# EAGLE design WIFI_Light (EAGLE 7.1.0)
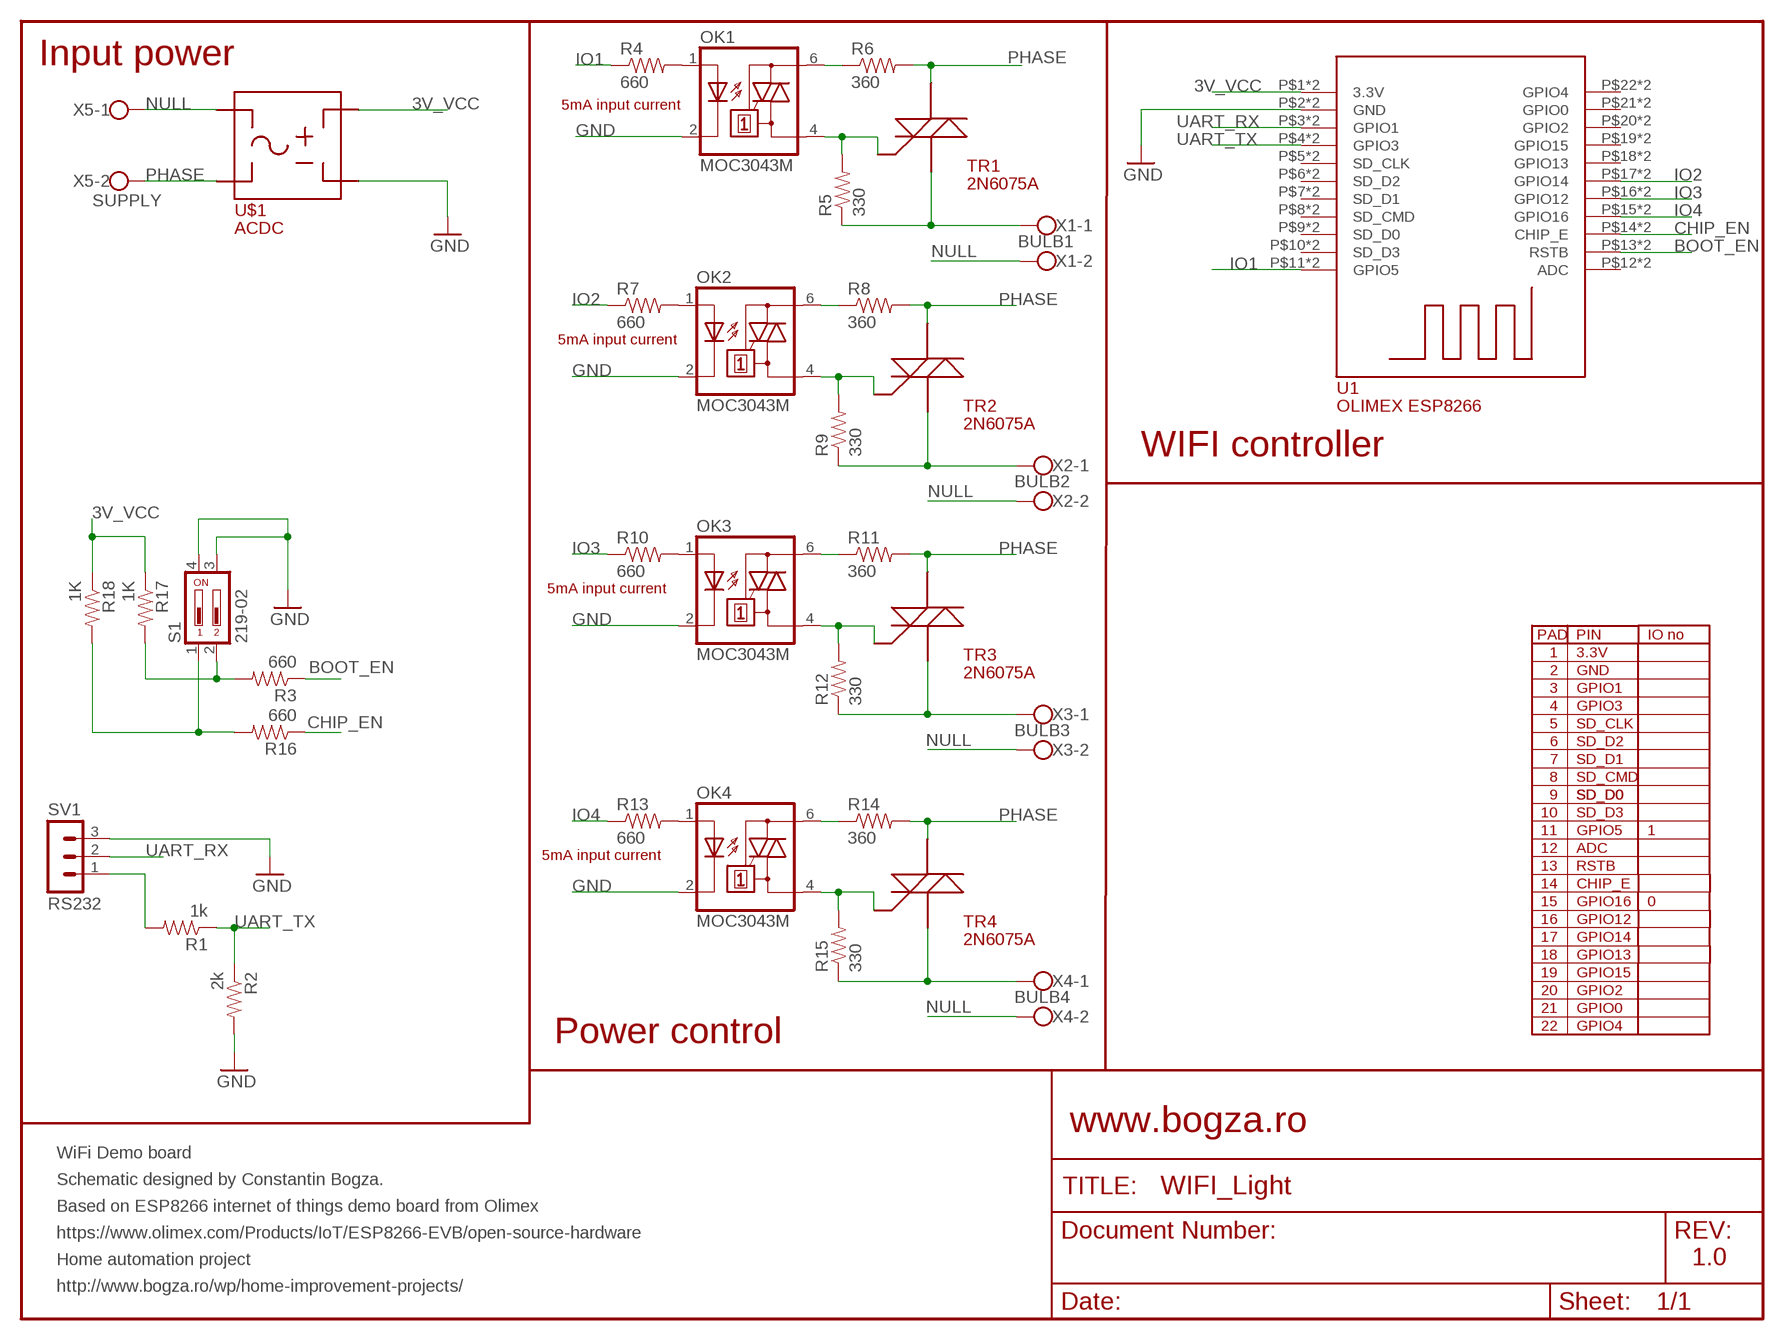
[diagram p0: schematic, sheet 1]

## Parts
OK1  MOC3043M  [DIL06]
OK2  MOC3043M  [DIL06]
OK3  MOC3043M  [DIL06]
OK4  MOC3043M  [DIL06]
R1  1k  RESISTOR1206  [1206]
R2  2k  RESISTOR1206  [1206]
R3  660  RESISTOR1206  [1206]
R4  660  RESISTOR1206  [1206]
R5  330  RESISTOR1206  [1206]
R6  360  RESISTOR1206  [1206]
R7  660  RESISTOR1206  [1206]
R8  360  RESISTOR1206  [1206]
R9  330  RESISTOR1206  [1206]
R10  660  RESISTOR1206  [1206]
R11  360  RESISTOR1206  [1206]
R12  330  RESISTOR1206  [1206]
R13  660  RESISTOR1206  [1206]
R14  360  RESISTOR1206  [1206]
R15  330  RESISTOR1206  [1206]
R16  660  RESISTOR1206  [1206]
R17  1K  RESISTOR1206  [1206]
R18  1K  RESISTOR1206  [1206]
S1  219-02  [CTS-219-02]
SV1  RS232  MA03-1  [MA03-1]
TR1  2N6071A/B  [TO–225AA]
TR2  2N6071A/B  [TO–225AA]
TR3  2N6071A/B  [TO–225AA]
TR4  2N6071A/B  [TO–225AA]
U1  OLIMEX_ESP8266  [OLIMEX_ESP8266_DIP22]
U$1  ACDC_220V_3V3  [ACDC_220V_3V3]
X1  BULB1  W237-102  [W237-102]
X2  BULB2  W237-102  [W237-102]
X3  BULB3  W237-102  [W237-102]
X4  BULB4  W237-102  [W237-102]
X5  SUPPLY  W237-102  [W237-102]

## Nets
3V_VCC: R17.1 R18.1 U1.P$1(3.3V) U1.P$23(3.3V) U$1.VCC
BOOT_EN: R3.1 U1.P$13(RSTB) U1.P$35(RSTB)
CHIP_EN: R16.1 U1.P$14(CHIP_E) U1.P$36(CHIP_E)
GND: OK1.2(C) OK2.2(C) OK3.2(C) OK4.2(C) R2.2 S1.3 S1.4 SV1.3 U1.P$2(GND) U1.P$24(GND) U$1.GND
IO1: R4.1 U1.P$11(GPIO5) U1.P$33(GPIO5)
IO2: R7.1 U1.P$17(GPIO14) U1.P$39(GPIO14)
IO3: R10.1 U1.P$16(GPIO12) U1.P$38(GPIO12)
IO4: R13.1 U1.P$15(GPIO16) U1.P$37(GPIO16)
N$1: OK1.6(A2) R6.1
N$2: OK1.1(A) R4.2
N$3: R3.2 R17.2 S1.2
N$5: R16.2 R18.2 S1.1
N$7: OK1.4(A1) R5.2 TR1.G
N$9: OK2.6(A2) R8.1
N$10: R1.2 SV1.1
N$13: OK2.1(A) R7.2
N$16: OK2.4(A1) R9.2 TR2.G
N$18: OK3.6(A2) R11.1
N$20: OK3.1(A) R10.2
N$23: OK3.4(A1) R12.2 TR3.G
N$25: OK4.6(A2) R14.1
N$27: OK4.1(A) R13.2
N$30: OK4.4(A1) R15.2 TR4.G
NULL: U$1.PHASE X1.2 X2.2 X3.2 X4.2 X5.1
OUT1: R5.1 TR1.MT1 X1.1
OUT2: R9.1 TR2.MT1 X2.1
OUT3: R12.1 TR3.MT1 X3.1
OUT4: R15.1 TR4.MT1 X4.1
PHASE: R6.2 R8.2 R11.2 R14.2 TR1.MT2 TR2.MT2 TR3.MT2 TR4.MT2 U$1.NULL X5.2
UART_RX: SV1.2 U1.P$3(GPIO1) U1.P$25(GPIO1)
UART_TX: R1.1 R2.1 U1.P$4(GPIO3) U1.P$26(GPIO3)
Unconnected: U1.P$5(SD_CLK) U1.P$6(SD_D2) U1.P$7(SD_D1) U1.P$8(SD_CMD) U1.P$9(SD_D0) U1.P$10(SD_D3) U1.P$12(ADC) U1.P$18(GPIO13) U1.P$19(GPIO15) U1.P$20(GPIO2) U1.P$21(GPIO0) U1.P$22(GPIO4) U1.P$27(SD_CLK) U1.P$28(SD_D2) U1.P$29(SD_D1) U1.P$30(SD_CMD) U1.P$31(SD_D0) U1.P$32(SD_D3) U1.P$34(ADC) U1.P$40(GPIO13) U1.P$41(GPIO15) U1.P$42(GPIO2) U1.P$43(GPIO0) U1.P$44(GPIO4)

## Notes on the sheet
- Input power
- 5mA input current
- 5mA input current
- WIFI controller
- 5mA input current
- PAD | PIN | IO no
- 1 | 3.3V
- 2 | GND
- 3 | GPIO1
- 4 | GPIO3
- 5 | SD_CLK
- 6 | SD_D2
- 7 | SD_D1
- 8 | SD_CMD
- 9 | SD_D0 | SD_D0
- 10 | SD_D3
- 11 | GPIO5 | 1
- 12 | ADC
- 5mA input current
- 13 | RSTB
- 14 | CHIP_E
- 15 | GPIO16 | 0
- 16 | GPIO12
- 17 | GPIO14
- 18 | GPIO13
- 19 | GPIO15
- 20 | GPIO2
- 21 | GPIO0
- 22 | GPIO4
- Power control
- www.bogza.ro
- WiFi Demo board
- Schematic designed by Constantin Bogza.
- Based on ESP8266 internet of things demo board from Olimex
- https://www.olimex.com/Products/IoT/ESP8266-EVB/open-source-hardware
- Home automation project | 1.0
- http://www.bogza.ro/wp/home-improvement-projects/

## Library data of the parts
OK1-OK4 = optocoupler:MOC30*: 6-Pin DIP Zero-Cross Optoisolators Triac Driver Output (250/400 Volt Peak) Source: Data sheet <http://www.fairchildsemi.com/ds/MO/MOC3031M.pdf> The old path of data sheet not more available 2013-05-06.; MF: FAIRCHILD SEMICONDUCTOR; MPN: MOC3043-M; OC_FARNELL: 1021371; OC_NEWARK: 72K8900
R1-R18 = SparkFun:RESISTOR: Resistor Basic schematic elements and footprints for 0603, 1206, and PTH 1/10th watt (small) resistors.
S1 = switch-dil:219-02*: Surface Mount DIP Switch Series 219 SMT CTS Electronic Components Sourc: www.ctscorp.com; OC_FARNELL: unknown; OC_NEWARK: unknown
SV1 = con-lstb:MA03-1: PIN HEADER; OC_FARNELL: unknown; OC_NEWARK: unknown
TR1-TR4 = Olimex_ESP8266:2N6071A/B
U1 = Olimex_ESP8266:OLIMEX_ESP8266
U$1 = Olimex_ESP8266:ACDC_220V_3V3
X1-X5 = con-wago-500:W237-102: WAGO SCREW CLAMP; MPN: 237-102; OC_FARNELL: unknown; OC_NEWARK: 70K9898

## Net classes
0 default: width 0.203 mm, drill 0.305 mm, clearance 0.205 mm

## Board
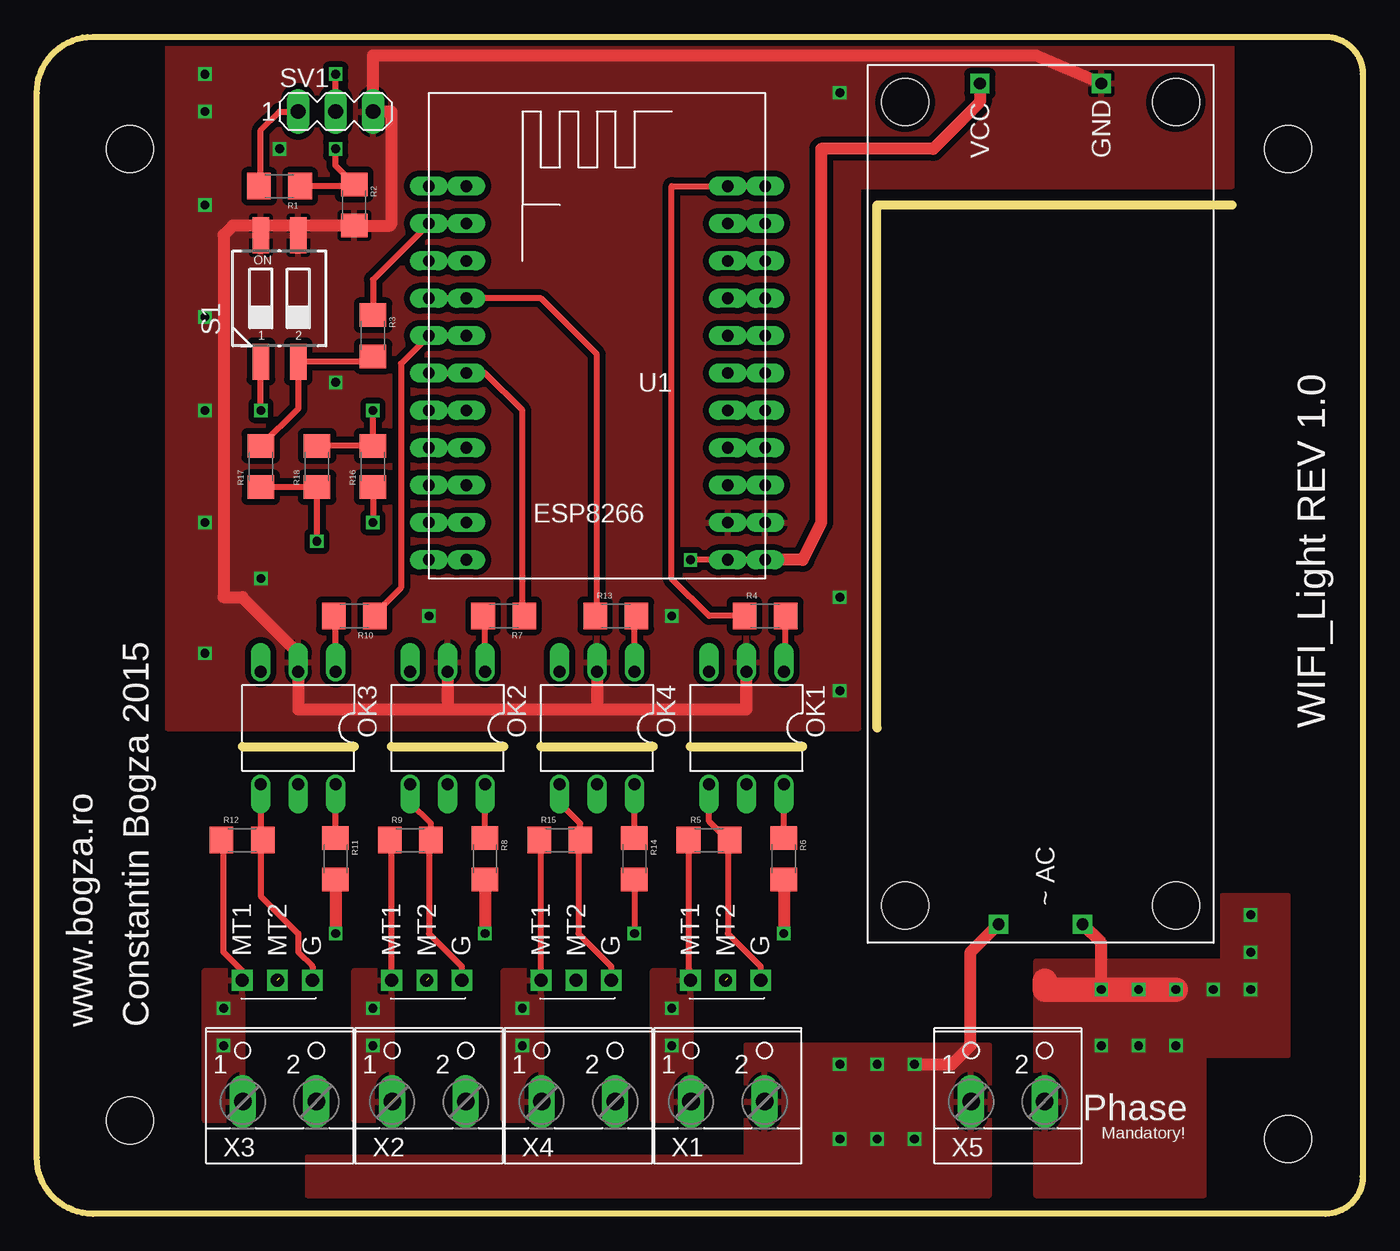
[diagram p1: board, top side]
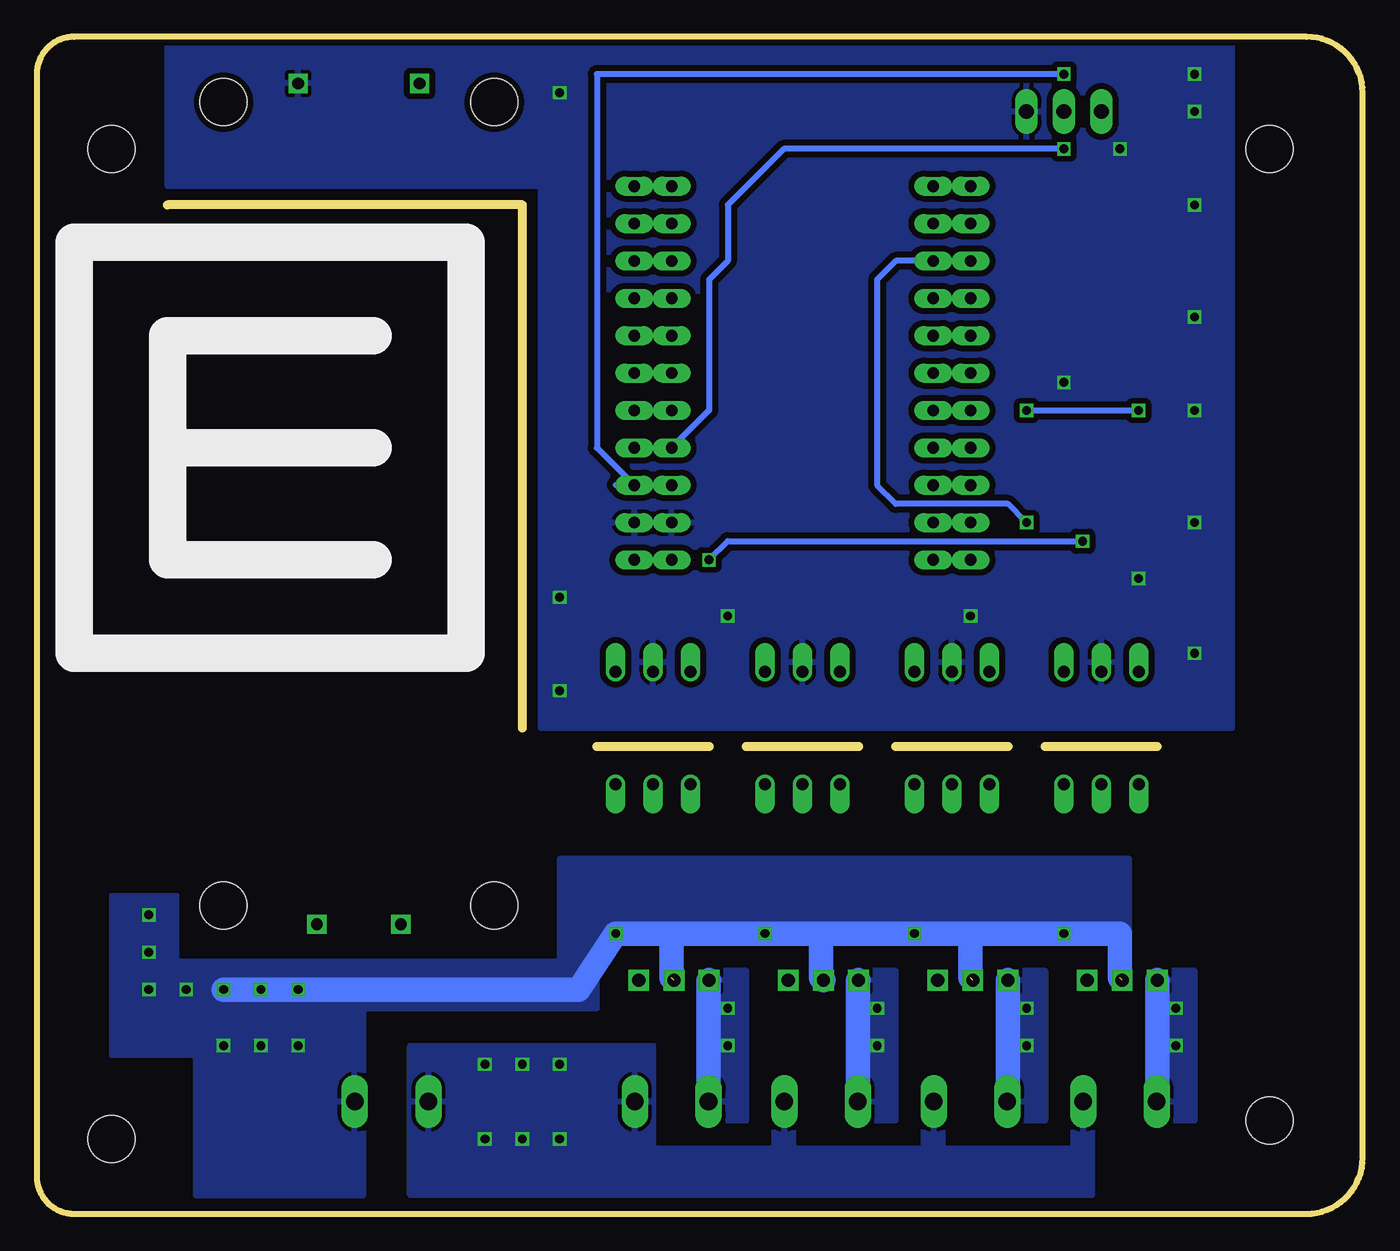
[diagram p2: board, bottom side, seen from below]

Size 90.17 x 80.01 mm. Coordinates in mm from the lower left corner, seen from the top.
Outline: 87.63,0 86.67,0
Outline: 87.63,0 3.81,0 arc-90 0,3.81 0,76.2 arc-90 3.81,80.01 87.63,80.01 arc-90 90.17,77.47 90.17,2.54 arc-90 87.63,0
Outline: 13.97,31.75 21.59,31.75
Outline: 24.13,31.75 31.75,31.75
Outline: 34.29,31.75 41.91,31.75
Outline: 44.45,31.75 52.07,31.75
Outline: 57.15,33.02 57.15,68.58 81.28,68.58
Copper layers (1*16): Top 0.035mm / dielectric 1.5mm / Bottom 0.035mm
Design rules "dirt_cheap_dirty_boards.v1": minimum track width 5mil, minimum drill 12mil, track to track 5mil, track to pad 5mil, pad to pad 5mil, via to via 5mil, smd to smd 0mil, copper to edge 10mil, drill to drill 10mil, minimum pad ring 10mil, minimum via ring 6mil, stop-mask expansion 2mil, vias tented up to drill 25mil, thermal gap 10mil
Holes 3.2 mm at 85.09,72.39 85.09,5.08 6.35,6.35 6.35,72.39

### Footprints (pad centres in the part's own frame; a part is rotated, then mirrored left to right if it is on the bottom)
DIL06 = drill 0.813 offset: 1 -2.54,-3.81; 2 0,-3.81; 3 2.54,-3.81; 4 2.54,3.81; 5 0,3.81; 6 -2.54,3.81
1206 = smd 1.6 x 1.8: 1 -1.4,0; 2 1.4,0
CTS-219-02 = smd 1.13 x 2.44: 1 -1.27,-4.3; 2 1.27,-4.3; 3 1.27,4.3; 4 -1.27,4.3
MA03-1 = drill 1.016 long: 1 -2.54,0; 2 0,0; 3 2.54,0
TO–225AA = drill 0.9 square: G 0,-4.775; MT1 0,0; MT2 0,-2.388
OLIMEX_ESP8266_DIP22 = drill 0.8 long: P$1 -8.89,17.78; P$2 -8.89,15.24; P$3 -8.89,12.7; P$4 -8.89,10.16; P$5 -8.89,7.62; P$6 -8.89,5.08; P$7 -8.89,2.54; P$8 -8.89,0; P$9 -8.89,-2.54; P$10 -8.89,-5.08; P$11 -8.89,-7.62; P$12 8.89,-7.62; P$13 8.89,-5.08; P$14 8.89,-2.54; P$15 8.89,0; P$16 8.89,2.54; P$17 8.89,5.08; P$18 8.89,7.62; P$19 8.89,10.16; P$20 8.89,12.7; P$21 8.89,15.24; P$22 8.89,17.78; P$23 -11.43,17.78; P$24 -11.43,15.24; P$25 -11.43,12.7; P$26 -11.43,10.16; P$27 -11.43,7.62; P$28 -11.43,5.08; P$29 -11.43,2.54; P$30 -11.43,0; P$31 -11.43,-2.54; P$32 -11.43,-5.08; P$33 -11.43,-7.62; P$34 11.43,-7.62; P$35 11.43,-5.08; P$36 11.43,-2.54; P$37 11.43,0; P$38 11.43,2.54; P$39 11.43,5.08; P$40 11.43,7.62; P$41 11.43,10.16; P$42 11.43,12.7; P$43 11.43,15.24; P$44 11.43,17.78
ACDC_220V_3V3 = drill 0.8 square: GND 30.48,0; NULL -26.67,1.27; PHASE -26.67,6.985; VCC 30.48,8.255 | hole 3.2: -25.4,13.335; 29.21,13.335; -25.4,-5.08; 29.21,-5.08
W237-102 = drill 1.194 long: 1 -2.5,-1.27; 2 2.5,-1.27

### Placement (x,y rotation side)
OK1  48.26,33.02 180 top
OK2  27.94,33.02 180 top
OK3  17.78,33.02 180 top
OK4  38.1,33.02 180 top
R1  16.51,69.85 180 top
R2  21.59,68.58 270 top
R3  22.86,59.69 270 top
R4  49.53,40.64 0 top
R5  45.72,25.4 0 top
R6  50.8,24.13 270 top
R7  31.75,40.64 180 top
R8  30.48,24.13 270 top
R9  25.4,25.4 0 top
R10  21.59,40.64 180 top
R11  20.32,24.13 270 top
R12  13.97,25.4 0 top
R13  39.37,40.64 0 top
R14  40.64,24.13 270 top
R15  35.56,25.4 0 top
R16  22.86,50.8 90 top
R17  15.24,50.8 90 top
R18  19.05,50.8 90 top
S1  16.51,62.23 0 top
SV1  20.32,74.93 0 top
TR1  44.45,15.88 90 top
TR2  24.13,15.88 90 top
TR3  13.97,15.88 90 top
TR4  34.29,15.88 90 top
U1  38.1,62.23 180 top
U$1  72.39,46.35 90 top
X1  46.99,8.89 0 top
X2  26.67,8.89 0 top
X3  16.51,8.89 0 top
X4  36.83,8.89 0 top
X5  66.04,8.89 0 top

### Tracks (layer width: path | path; a pad name or v marks a point on that pad's centre or on a via)
3V_VCC  (via drill 0.6)
  Top 0.406: U1.P$23 U1.P$1 v44.45,44.45 | v19.05,45.72 R18.1 R17.1
  Top 0.813: U1.P$23 52.07,44.45 53.34,46.99 53.34,72.39 60.96,72.39 64.14,75.56 U$1.VCC
  Bottom 0.406: v44.45,44.45 43.18,45.72 v19.05,45.72
BOOT_EN
  Top 0.406: U1.P$13 U1.P$35 22.86,63.5 R3.1
CHIP_EN  (via drill 0.6)
  Top 0.406: R16.1 v22.86,46.99
  Bottom 0.406: v22.86,46.99 24.13,48.26 31.75,48.26 33.02,49.53 33.02,63.5 31.75,64.77 U1.P$14 U1.P$36
GND  (via drill 0.6)
  Top 0.813: 17.78,67.18 R2.2 24,67.18 24.13,67.31 24.13,74.93 SV1.3 22.86,78.74 67.94,78.74 U$1.GND | 17.78,67.18 15.24,67.18 | 15.24,67.18 13.35,67.18 12.7,66.53 12.7,41.91 13.97,41.91 17.78,38.1 OK3.2 17.78,34.29 27.94,34.29 | S1.3 17.78,67.18 | S1.4 15.24,67.18 | OK2.2 27.94,34.29 | 27.94,34.29 38.1,34.29 | OK4.2 38.1,34.29 | 38.1,34.29 48.26,34.29 OK1.2
  other vias: 11.43,77.47 11.43,74.93 11.43,68.58 11.43,60.96 11.43,54.61 11.43,46.99 11.43,38.1 15.24,43.18 26.67,40.64 43.18,40.64 54.61,41.91 54.61,35.56 54.61,76.2 16.51,72.39 20.32,56.52
  pour Top (isolate 0.406): 8.89,33.02 55.88,33.02 55.88,69.85 81.28,69.85 81.28,80.01 8.89,80.01
  pour Bottom (isolate 0.406): 8.89,80.01 8.89,33.02 55.88,33.02 55.88,69.85 81.28,69.85 81.28,80.01
IO1
  Top 0.406: R4.1 45.72,40.64 43.18,43.18 43.18,69.85 U1.P$11 U1.P$33
IO2
  Top 0.406: R7.1 33.02,40.77 33.02,54.61 30.48,57.15 U1.P$17 U1.P$39
IO3
  Top 0.406: U1.P$16 U1.P$38 24.77,57.78 24.77,42.55 22.99,40.77 R10.1
IO4
  Top 0.406: R13.1 38.1,40.77 38.1,58.42 34.29,62.23 U1.P$15 U1.P$37
N$1
  Top 0.406: R6.1 OK1.6
N$2
  Top 0.406: OK1.1 50.93,36.96 R4.2
N$3
  Top 0.406: R3.2 22.5,57.93 S1.2 17.78,54.74 R17.2
N$5  (via drill 0.6)
  Top 0.406: R18.2 R16.2 v22.86,54.61 | v15.24,54.61 S1.1
  Bottom 0.406: v22.86,54.61 v15.24,54.61
N$7
  Top 0.406: OK1.4 45.72,26.67 46.99,25.4 R5.2 46.99,25.27 46.99,19.05 49.23,16.82 TR1.G
N$9
  Top 0.406: R8.1 OK2.6
N$10
  Top 0.406: R1.2 15.24,69.98 15.24,73.66 16.51,74.93 SV1.1
N$13
  Top 0.406: OK2.1 30.48,40.64 R7.2
N$16
  Top 0.406: OK2.4 25.4,27.94 26.8,26.54 R9.2 26.67,25.4 26.67,19.05 28.91,16.82 TR2.G
N$18
  Top 0.406: R11.1 OK3.6
N$20
  Top 0.406: OK3.1 20.32,40.51 R10.2
N$23
  Top 0.406: OK3.4 15.24,25.53 R12.2 15.24,25.27 15.24,21.59 17.78,19.05 17.78,17.78 18.75,16.82 TR3.G
N$25
  Top 0.406: R14.1 OK4.6
N$27
  Top 0.406: OK4.1 40.64,40.51 R13.2
N$30
  Top 0.406: OK4.4 35.56,27.94 36.96,26.54 R15.2 36.83,25.27 36.83,19.05 39.06,16.82 TR4.G
NULL  (via drill 0.6)
  Top 0.813: v59.69,10.16 62.23,10.16 63.5,11.43 63.5,17.78 U$1.PHASE
  other vias: 54.61,10.16 57.15,10.16 54.61,5.08 57.15,5.08 59.69,5.08
  pour Top (isolate 0.406): 18.41,3.81 18.41,1.27 64.77,1.27 64.77,11.43 48.26,11.43 48.26,3.81
  pour Bottom (isolate 0.406): 18.41,8.89 18.41,1.27 64.77,1.27 64.77,11.43 48.26,11.43 48.26,4.45 40.01,4.45 40.01,8.89 38.73,8.89 38.73,4.45 29.84,4.45 29.84,8.89 28.57,8.89 28.57,4.45 19.68,4.45 19.68,8.89
OUT1  (via drill 0.6)
  Top 0.406: R5.1 44.32,16 TR1.MT1
  Bottom 1.676: X1.1 44.49,15.84 TR1.MT1
  other vias: 43.18,13.97 43.18,11.43
  pour Bottom (isolate 0.406): 41.91,16.51 45.09,16.51 45.09,6.35 41.91,6.35
  pour Top (isolate 0.406): 41.91,16.51 44.45,16.51 44.45,6.35 41.91,6.35
OUT2  (via drill 0.6)
  Top 0.406: TR2.MT1 24.13,25.27 R9.1
  Bottom 1.676: TR2.MT1 24.13,7.66 X2.1
  other vias: 22.86,13.97 22.86,11.43
  pour Bottom (isolate 0.406): 21.59,16.51 24.77,16.51 24.77,6.35 21.59,6.35
  pour Top (isolate 0.406): 21.59,16.51 24.13,16.51 24.13,6.35 21.59,6.35
OUT3  (via drill 0.6)
  Top 0.406: TR3.MT1 13.97,16.51 12.7,17.78 12.7,25.27 R12.1
  Bottom 1.676: TR3.MT1 13.97,7.66 X3.1
  other vias: 12.7,13.97 12.7,11.43
  pour Bottom (isolate 0.406): 11.43,16.51 14.61,16.51 14.61,6.35 11.43,6.35
  pour Top (isolate 0.406): 11.43,16.51 13.97,16.51 13.97,6.35 11.43,6.35
OUT4  (via drill 0.6)
  Top 0.406: TR4.MT1 34.29,25.27 R15.1
  Bottom 1.676: X4.1 34.33,15.84 TR4.MT1
  other vias: 33.02,13.97 33.02,11.43
  pour Bottom (isolate 0.406): 31.75,16.51 34.92,16.51 34.92,6.35 31.75,6.35
  pour Top (isolate 0.406): 31.75,16.51 34.29,16.51 34.29,6.35 31.75,6.35
PHASE  (via drill 0.6)  (3 unrouted)
  Top 0.406: R14.2 v40.64,19.05
  Top 0.813: v72.39,15.24 72.39,18.41 U$1.NULL | R6.2 v50.8,19.05 | R8.2 v30.48,19.05 | R11.2 v20.32,19.05
  Top 1.676: 68.54,15.84 68.54,15.24 v72.39,15.24 v77.47,15.24
  Bottom 1.676: 46.99,19.05 v50.8,19.05 53.34,15.24 v72.39,15.24 v74.93,15.24 v77.47,15.24 | 46.99,19.05 46.99,16.03 | 46.84,18.9 46.99,19.05 | 46.99,19.05 v40.64,19.05 36.83,19.05 | 36.83,19.05 36.83,16.03 TR4.MT2 | 36.83,19.05 v30.48,19.05 26.67,19.05 | 26.67,19.05 26.67,16.03 | 26.67,19.05 v20.32,19.05 16.51,19.05 16.51,16.03
  other vias: 80.01,15.24 82.55,15.24 82.55,17.78 82.55,20.32 72.39,11.43 74.93,11.43 77.47,11.43
  pour Top (isolate 0.406): 67.94,17.14 67.94,1.27 79.38,1.27 79.38,10.79 85.09,10.79 85.09,21.59 80.64,21.59 80.64,17.14
  pour Bottom: 15.88,24.13 54.61,24.13 54.61,17.14 80.64,17.14 80.64,21.59 85.09,21.59 85.09,13.97 52.07,13.97 52.07,18.41 15.88,18.41
  pour Bottom (isolate 0.406): 85.09,13.97 85.09,11.43 85.09,10.79 79.38,10.79 79.38,1.27 67.94,1.27 67.94,13.97
UART_RX  (via drill 0.6)
  Top 0.406: SV1.2 v20.32,77.47
  Bottom 0.406: 50.8,49.53 U1.P$25 | 48.26,49.53 U1.P$3 U1.P$25 | v20.32,77.47 52.07,77.47 52.07,52.07 U1.P$25
UART_TX  (via drill 0.6)
  Top 0.406: R1.1 21.46,69.85 R2.1 20.32,71.25 v20.32,72.39
  Bottom 0.406: v20.32,72.39 39.37,72.39 43.18,68.58 43.18,64.77 44.45,63.5 44.45,54.61 U1.P$4 U1.P$26

### Text on the board
tPlace: WIFI_Light REV 1.0 | www.bogza.ro | Constantin Bogza 2015 | Phase | Mandatory!